# Altium schematic sheet Sheet2.SchDoc
size A portrait; SheetNumber: 1; SheetTotal: 1
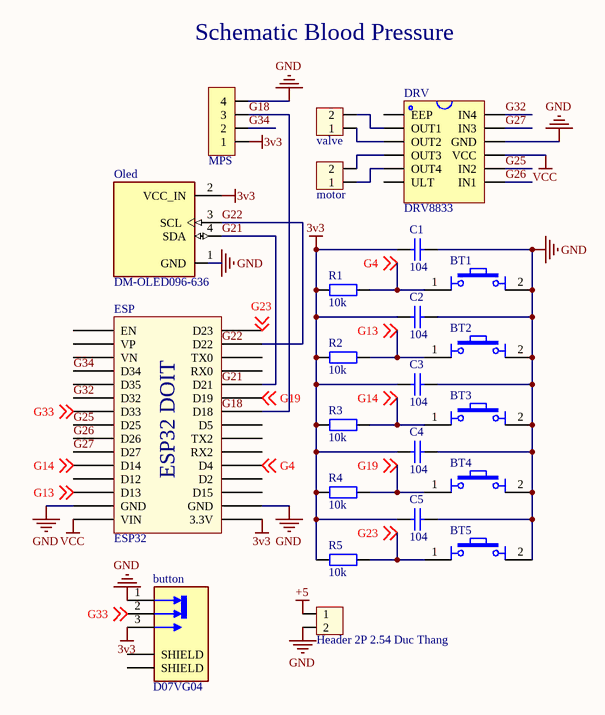
[diagram p0: Sheet2.SchDoc]

## Parts
BT1  (no value)  [Nut Nhan 4 Chan Cam 6x6]
BT2  (no value)  [Nut Nhan 4 Chan Cam 6x6]
BT3  (no value)  [Nut Nhan 4 Chan Cam 6x6]
BT4  (no value)  [Nut Nhan 4 Chan Cam 6x6]
BT5  (no value)  [Nut Nhan 4 Chan Cam 6x6]
button  D07VG04  [SW_SS12D07VG4]
C1  104  [tu 0805]
C2  104  [tu 0805]
C3  104  [tu 0805]
C4  104  [tu 0805]
C5  104  [tu 0805]
DRV  DRV8833  [DRV8833]
ESP  ESP32  [ESP32 WROOM 32 KIT]
motor  motor  [XH2.54M-2]
Mps  MPS  [JP 1x4 CT]
Oled  DM-OLED096-636  [MODULE_DM-OLED096-636]
Pin  Header 2P 2.54 Duc Thang  [XH2.54M-2]
R1  10k  [tro smd 0805]
R2  10k  [tro smd 0805]
R3  10k  [tro smd 0805]
R4  10k  [tro smd 0805]
R5  10k  [tro smd 0805]
valve  valve  [XH2.54M-2]

## Nets
3v3: button.3 C1.2 C2.2 C3.2 C4.2 C5.2 ESP.16(3.3V) Mps.1 Oled.2(VCC_IN) R1.1 R2.1 R3.1 R4.1 R5.1
+5: Pin.1
GND: BT1.2 BT2.2 BT3.2 BT4.2 BT5.2 button.1 C1.1 C2.1 C3.1 C4.1 C5.1 DRV.10(GND) ESP.14(GND) ESP.17(GND) Mps.4 Oled.1(GND) Pin.2
VCC: DRV.9(VCC) ESP.15(VIN)
G4: BT1.1 ESP.20(D4) R1.2 ; off-sheet G4
G13: BT2.1 ESP.13(D13) R2.2 ; off-sheet G13
G14: BT3.1 ESP.11(D14) R3.2 ; off-sheet G14
G18: ESP.24(D18) Mps.3
G19: BT4.1 ESP.25(D19) R4.2 ; off-sheet G19
G21: ESP.26(D21) Oled.4(SDA)
G22: ESP.29(D22) Oled.3(SCL)
G23: BT5.1 ESP.30(D23) R5.2 ; off-sheet G23
G25: DRV.8(IN2) ESP.8(D25)
G26: DRV.7(IN1) ESP.9(D26)
G27: DRV.11(IN3) ESP.10(D27)
G32: DRV.12(IN4) ESP.6(D32)
G33: button.2 ESP.7(D33) ; off-sheet G33
G34: ESP.4(D34) Mps.2
NetDRV_2: DRV.2(OUT1) valve.2
NetDRV_3: DRV.3(OUT2) valve.1
NetDRV_4: DRV.4(OUT3) motor.2
NetDRV_5: DRV.5(OUT4) motor.1

Not connected (* = marked no-connect by the designer): button S1(SHIELD) S2(SHIELD); DRV 1(EEP) 6(ULT); ESP 1(EN) 2(VP) 3(VN) 5(D35) 12(D12) 18(D15) 19(D2) 21(RX2) 22(TX2) 23(D5) 27(RX0) 28(TX0)

## Notes on the sheet
- Schematic Blood Pressure
- Labels drawn without touching a wire or pin: G18, G21, G22
- (in symbol ESP32 WROOM 32 KIT) ESP32 DOIT

## Library data of the parts
BT1-BT5 = Nut Nhan 4 Chan Cam 6x6: Nut Nhan 4 Chan 6x6mm; Ten: Nút Nhấn 4 Chân 6x6x5MM DIP; Ma_Hang: MH004584
button = SS12D07VG4: Switch Slide ON ON SPDT Top Slide 0.3A 30VDC PC Pins Bracket Mount/Through Hole Automotive Bulk; MF: Shouhan; SnapEDA_Link: https://www.snapeda.com/parts/SS12D07VG4/Shouhan/view-part/?ref=snap; Package: Package; Value: *; MP: SS12D07VG4; Check_prices: https://www.snapeda.com/parts/SS12D07VG4/Shouhan/view-part/?ref=eda
C1-C5 = Tu 0805 104 50V 10%: Dán; Don_Vi: Con; So_Chan: 2; Ten_Linh_Kien: Tụ 0805 104-100nF 10% 50V; Ma_Hang: MH004551; Chung_Loai: Dán; Kieu_Chan: *
ESP = ESP32 WROOM 32 KIT
motor Pin valve = Header 2P 2.54 Duc Thang: Cắm; Ten_Linh_Kien: Header 2P XH2.54-2P Đực Thẳng; Don_Vi: Con; Ma_Hang: MH001283; Chung_Loai: Cắm
Mps = JP 1x4 2.54 Cai Thang: Cắm; Ten_Linh_Kien: Jump Đơn Cái 2.54MM 1x20P Thẳng; Don_Vi: Con; Ma_Hang: MH004006; Ghi_Chu: *; Kieu_Chan: *; Chung_Loai: Cắm
Oled = DM-OLED096-636: 0.96â€ 128 X 64 MONOCHROME GRAPHIC OLED DISPLAY MODULE - I2C; SnapEDA_Link: https://www.snapeda.com/parts/DM-OLED096-636/Display+Module/view-part/?ref=snap; Package: Package; Value: *; MF: Display Module; MP: DM-OLED096-636; Check_prices: https://www.snapeda.com/parts/DM-OLED096-636/Display+Module/view-part/?ref=eda
R1-R5 = Tro 0805 1% 10k: Dán; Don_Vi: Con; So_Chan: 2; Ten_Linh_Kien: Trở 0805 1% 10k; Ma_Hang: MH005473; Chung_Loai: Dán; Kieu_Chan: *